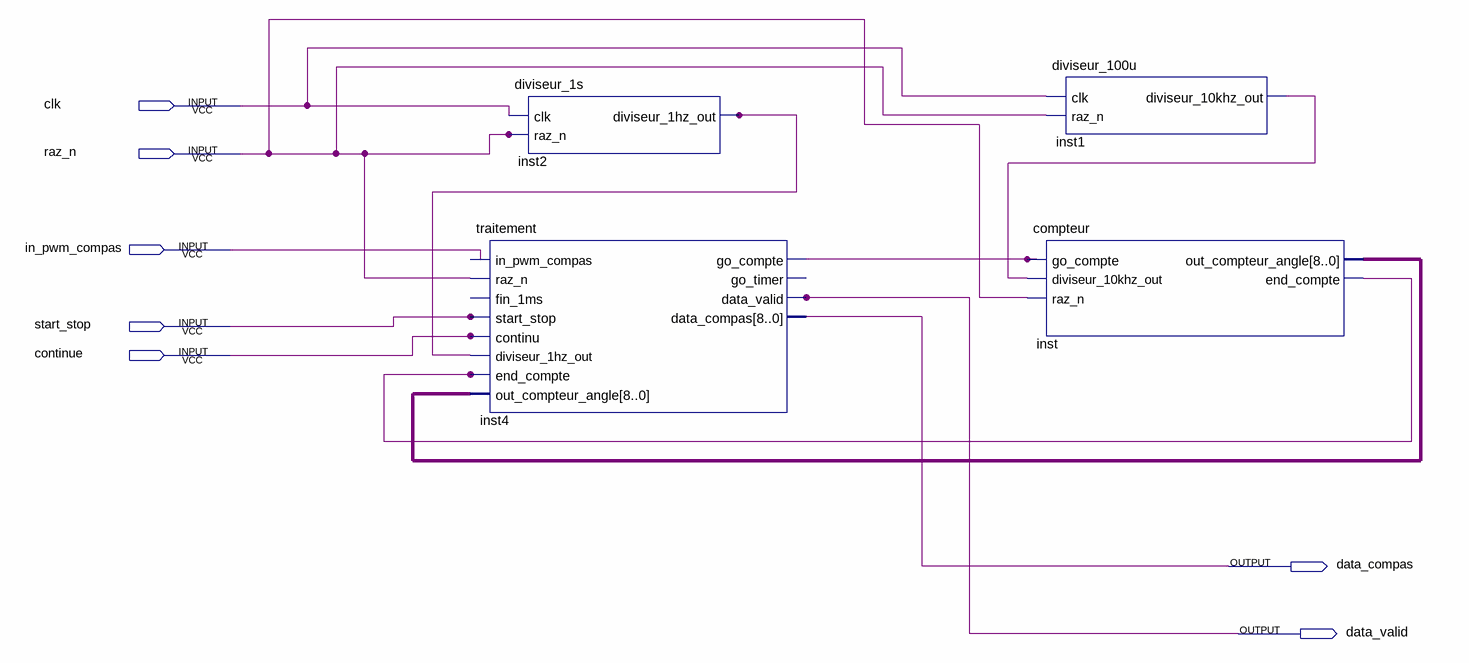
[diagram p0: schematic sheet]
// Quartus schematic Compas.bdf as structural Verilog: 4 symbols, 7 pins
module Compas (
  input  clk,
  input  raz_n,
  input  in_pwm_compas,
  input  start_stop,
  input  \continue ,
  output data_compas,
  output data_valid
);

  wire inst1_diviseur_10khz_out, inst2_diviseur_1hz_out, inst4_go_compte, inst_end_compte;
  wire [8:0] inst_out_compteur_angle;

  diviseur_1s inst2 (.clk(clk), .raz_n(raz_n), .diviseur_1hz_out(inst2_diviseur_1hz_out));
  traitement inst4 (
    .raz_n(raz_n), .start_stop(start_stop), .continu(\continue ), .diviseur_1hz_out(inst2_diviseur_1hz_out),
    .end_compte(inst_end_compte), .out_compteur_angle(inst_out_compteur_angle), .go_compte(inst4_go_compte),
    .data_valid(data_valid), .data_compas(data_compas));  // open: in_pwm_compas, fin_1ms, go_timer
  diviseur_100u inst1 (.clk(clk), .raz_n(raz_n), .diviseur_10khz_out(inst1_diviseur_10khz_out));
  compteur inst (
    .go_compte(inst4_go_compte), .diviseur_10khz_out(inst1_diviseur_10khz_out), .raz_n(raz_n),
    .out_compteur_angle(inst_out_compteur_angle), .end_compte(inst_end_compte));
endmodule
